# Altium schematic sheet Main.SchDoc
size A4; SheetNumber: 1; SheetTotal: 8
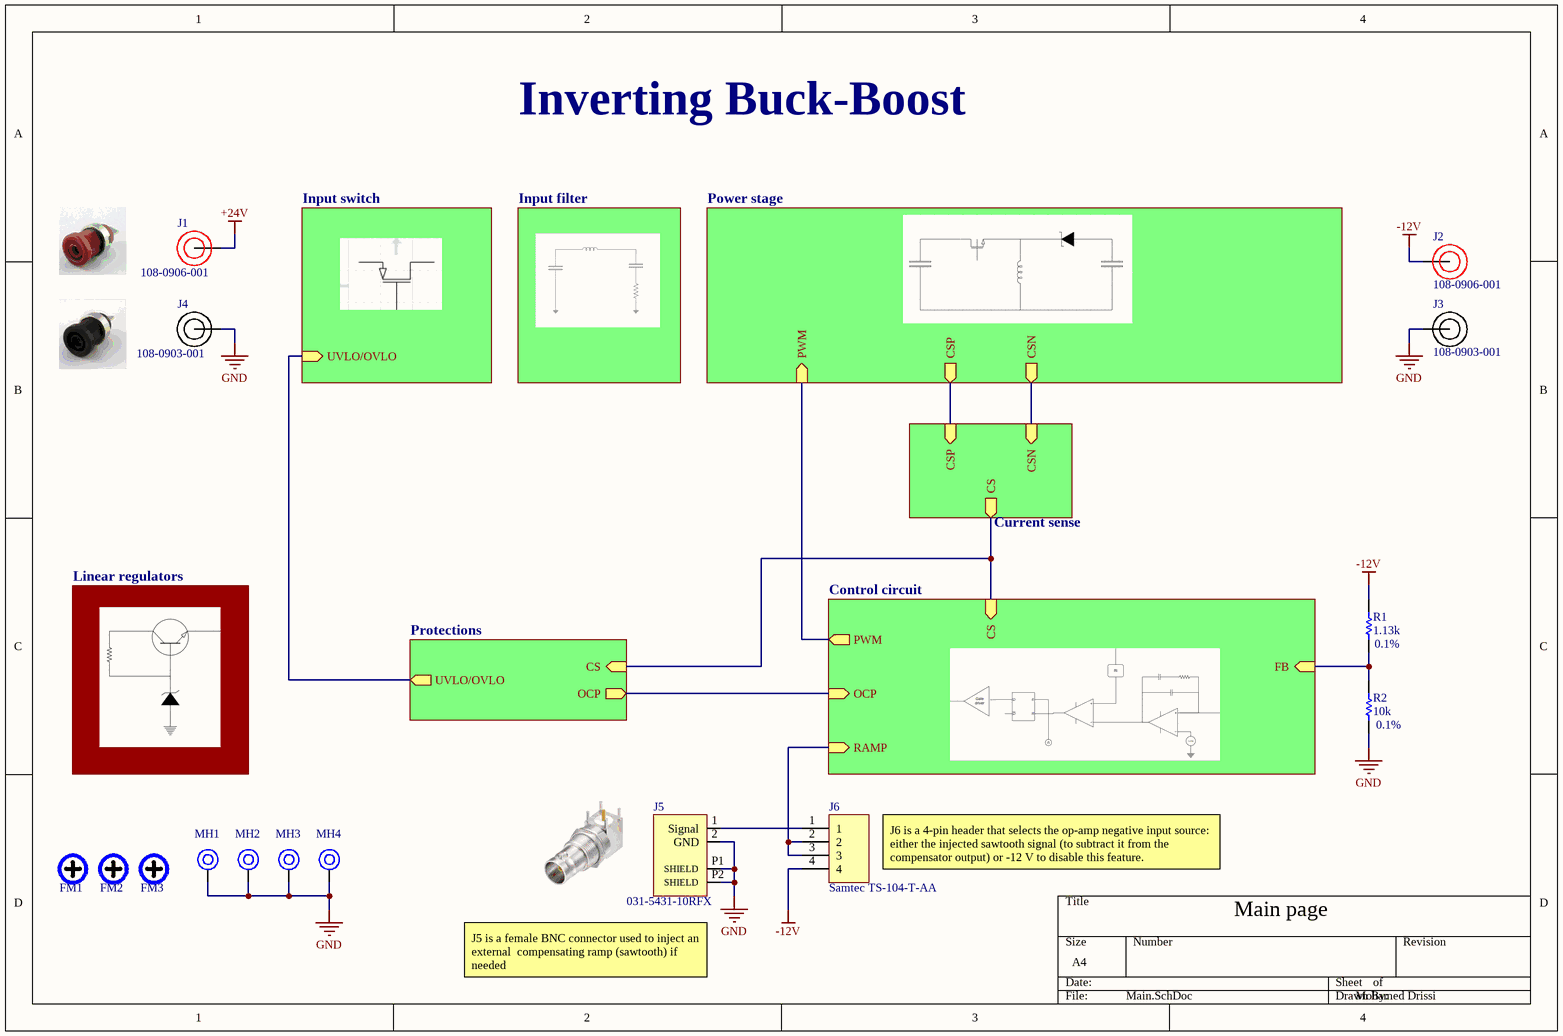
[diagram p0: Main.SchDoc]

## Parts
FM1  Fiducial Marker  [FIDUCIAL_CROSS_1MM5]  (value not drawn)  (no BOM)
FM2  Fiducial Marker  [FIDUCIAL_CROSS_1MM5]  (value not drawn)  (no BOM)
FM3  Fiducial Marker  [FIDUCIAL_CROSS_1MM5]  (value not drawn)  (no BOM)
J1  108-0906-001  [Black Banana connector Solder terminal]
J2  108-0906-001  [Black Banana connector Solder terminal]
J3  108-0903-001  [Black Banana connector Solder terminal]
J4  108-0903-001  [Black Banana connector Solder terminal]
J5  031-5431-10RFX  [031-5431-10RFX BNC]
J6  Samtec TS-104-T-AA  [CONN HEADER VERT 4POS 2.54MM]
MH1  Mounting Hole  [MOUNTING]  (value not drawn)  (no BOM)
MH2  Mounting Hole  [MOUNTING]  (value not drawn)  (no BOM)
MH3  Mounting Hole  [MOUNTING]  (value not drawn)  (no BOM)
MH4  Mounting Hole  [MOUNTING]  (value not drawn)  (no BOM)
R1  Tolerance: 0.1%  Resistance: 1.13k  [RES_0603]  (hidden comment: RT0603BRD071K13L)
R2  Tolerance: 0.1%  Resistance: 10k  [res_0603]  (hidden comment: ERA-3AEB103V)

## Sub-sheets
Control circuit = Control circuit.SchDoc: FB (in), CS (in), RAMP (in), PWM (out), OCP (in)
Current sense = current sense.SchDoc: CSP (in), CSN (in), CS (out)
Input filter = Input filter.SchDoc: no entries
Input switch = Input switch.SchDoc: UVLO/OVLO (in)
Linear regulators = Linear regulators.SchDoc: no entries
Power stage = Power stage.SchDoc: CSN (out), CSP (out), PWM (in)
Protections = Protections.SchDoc: UVLO/OVLO (out), CS (in), OCP (out)

## Nets
+24V: J1.1
-12V: J2.1 J6.4 R1.2
GND: J3.1 J4.1 J5.2(GND) J5.P1(SHIELD) J5.P2(SHIELD) MH1.1 MH2.1 MH3.1 MH4.1 R2.1
NetJ5_1: J5.1(Signal) J6.1
NetJ6_2: J6.2 J6.3 ; sheet Control circuit/RAMP
NetR1_1: R1.1 R2.2 ; sheet Control circuit/FB
(unnamed): sheet Power stage/CSN, sheet Current sense/CSN
(unnamed): sheet Power stage/CSP, sheet Current sense/CSP
(unnamed): sheet Power stage/PWM, sheet Control circuit/PWM
(unnamed): sheet Current sense/CS, sheet Protections/CS, sheet Control circuit/CS
(unnamed): sheet Input switch/UVLO/OVLO, sheet Protections/UVLO/OVLO
(unnamed): sheet Protections/OCP, sheet Control circuit/OCP

## Notes on the sheet
- Inverting Buck-Boost
- J6 is a 4-pin header that selects the op-amp negative input source: either the injected sawtooth signal (to subtract it from the compensator output) or -12 V to disable this feature.
- Main page
- (near J5) J5 is a female BNC connector used to inject an external  compensating ramp (sawtooth) if needed
- Mohamed Drissi

## Library data of the parts
FM1-FM3 = FIDUCIAL_CROSS_1MM5: Fiducial Marker Cross 1.5mm NO BOM
J1 J2 = Cinch 108-0906-001: Right-angle Dual Port D-Sub Connector; Manufacturer: Cinch Connectivity Solutions; Approvals: UL; Body Material: Brass, Nylon, Polyamide; Current Rating: 15A; Gender: Female; Insulation: Mating End Insulated; Number of Contacts: 1; Voltage Rating: 3.5kV; Voltage Rating (DC): 7kV; Wire/Cable Gauge: 12AWG; Supplier: Avnet; Supplier Part Number: 39F1578; Manufacturer Part Number: 108-0906-001; RoHS: Compliant; Category: Connectors; Stock: 6182; Pricing: 1=1,33, 10=1,13, 50=1,03, 100=0,961, 250=0,9, 500=0,857, 1000=0,816 (USD); Case/Package: 0906; Color: Orange; Contact Material: Brass; Contact Plating: Tin; Export Control Classification Number (ECCN) Code: EAR99; Insulation Material: Nylon; Lead Free: Lead Free; Length: 23.83mm; Lifecycle Status: Production; Max Current Rating: 15A; Max Operating Temperature: 85°C; Min Operating Temperature: -55°C; Mounting Technology: Panel; Orientation: Straight; Packaging: Bulk; Radiation Hardening: No; REACH SVHC: No; Termination: Solder; ComponentLink1URL: https://datasheet.octopart.com:443/108-0906-001-Cinch-Connectors-datasheet-87927859.pdf?src-supplier=element14+APAC; ComponentLink1Description: https://datasheet.octopart.com:443/108-0906-001-Cinch-Connectors-datasheet-87927859.pdf?src-supplier=element14+APAC; ComponentLink2URL: https://datasheet.octopart.com:443/108-0906-001-Cinch-Connectors-datasheet-26078.pdf?src-supplier=element14+APAC; ComponentLink2Description: https://datasheet.octopart.com:443/108-0906-001-Cinch-Connectors-datasheet-26078.pdf?src-supplier=element14+APAC; ComponentLink3URL: https://datasheet.octopart.com:443/108-0906-001-Cinch-Connectivity-Solutions-datasheet-180501184.pdf?src-supplier=IHS; ComponentLink3Description: https://datasheet.octopart.com:443/108-0906-001-Cinch-Connectivity-Solutions-datasheet-180501184.pdf?src-supplier=IHS; ComponentLink4URL: https://datasheet.octopart.com:443/108-0906-001-Cinch-Connectors-datasheet-13703871.pdf?src-supplier=_legacy+Avnet; ComponentLink4Description: https://datasheet.octopart.com:443/108-0906-001-Cinch-Connectors-datasheet-13703871.pdf?src-supplier=_legacy+Avnet; ComponentLink5URL: https://datasheet.octopart.com:443/108-0906-001-Cinch-Connectivity-Solutions-datasheet-128871933.pdf?src-supplier=RS+(Formerly+Allied+Electronics); ComponentLink5Description: https://datasheet.octopart.com:443/108-0906-001-Cinch-Connectivity-Solutions-datasheet-128871933.pdf?src-supplier=RS+(Formerly+Allied+Electronics); ComponentLink6URL: https://datasheet.octopart.com:443/108-0906-001-Cinch-Connectors-datasheet-10014739.pdf?src-supplier=RS+(Formerly+Allied+Electronics); ComponentLink6Description: https://datasheet.octopart.com:443/108-0906-001-Cinch-Connectors-datasheet-10014739.pdf?src-supplier=RS+(Formerly+Allied+Electronics); ComponentLink7URL: https://datasheet.octopart.com:443/108-0906-001-Emerson-Network-Power-datasheet-16473276.pdf?src-supplier=Farnell; ComponentLink7Description: https://datasheet.octopart.com:443/108-0906-001-Emerson-Network-Power-datasheet-16473276.pdf?src-supplier=Farnell
J3 J4 = Cinch 108-0903-001: Banana Test Connector, 4mm, Jack, Panel Mount, 15 A, 7 kV, Tin Plated Contacts, Black; Manufacturer: Cinch Connectivity Solutions; Approvals: UL; Body Material: Brass, Nylon, Polyamide; Current Rating: 15A; Gender: Female; Insulation: Mating End Insulated; Number of Contacts: 1; Voltage Rating: 3.5kV; Voltage Rating (DC): 7kV; Wire/Cable Gauge: 12AWG; Supplier: RS; Supplier Part Number: 8860910; Manufacturer Part Number: 108-0903-001; RoHS: Compliant; Category: Connectors; Stock: 5600; Pricing: 50=0,928, 500=0,742, 1000=0,699 (EUR); Color: Black; Contact Material: Tin; Contact Plating: Tin; Country of Origin: USA; Export Control Classification Number (ECCN) Code: EAR99; Insulation Material: Nylon; Lead Free: Lead Free; Length: 23.83mm; Lifecycle Status: Production; Max Current Rating: 15A; Max Operating Temperature: 85°C; Min Operating Temperature: -55°C; Mounting Technology: Panel; Orientation: Straight; Packaging: Bulk; Radiation Hardening: No; REACH SVHC: No; Termination: Solder; ComponentLink1URL: https://datasheet.octopart.com:443/108-0903-001-Cinch-Connectivity-Solutions-datasheet-128871933.pdf?src-supplier=JRH+Electronics; ComponentLink1Description: https://datasheet.octopart.com:443/108-0903-001-Cinch-Connectivity-Solutions-datasheet-128871933.pdf?src-supplier=JRH+Electronics; ComponentLink2URL: https://datasheet.octopart.com:443/108-0903-001-Cinch-Connectors-datasheet-38159153.pdf?src-supplier=element14+APAC; ComponentLink2Description: https://datasheet.octopart.com:443/108-0903-001-Cinch-Connectors-datasheet-38159153.pdf?src-supplier=element14+APAC; ComponentLink3URL: https://datasheet.octopart.com:443/108-0903-001-Cinch-Connectivity-Solutions-datasheet-180501184.pdf?src-supplier=IHS; ComponentLink3Description: https://datasheet.octopart.com:443/108-0903-001-Cinch-Connectivity-Solutions-datasheet-180501184.pdf?src-supplier=IHS; ComponentLink4URL: https://datasheet.octopart.com:443/108-0903-001-Emerson-Network-Power-datasheet-82039.pdf?src-supplier=element14; ComponentLink4Description: https://datasheet.octopart.com:443/108-0903-001-Emerson-Network-Power-datasheet-82039.pdf?src-supplier=element14; ComponentLink5URL: https://datasheet.octopart.com:443/108-0903-001-Cinch-Connectors-datasheet-13701575.pdf?src-supplier=_legacy+Avnet; ComponentLink5Description: https://datasheet.octopart.com:443/108-0903-001-Cinch-Connectors-datasheet-13701575.pdf?src-supplier=_legacy+Avnet; ComponentLink6URL: https://datasheet.octopart.com:443/108-0903-001-Cinch-Connectors-datasheet-9780463.pdf?src-supplier=RS+(Formerly+Allied+Electronics); ComponentLink6Description: https://datasheet.octopart.com:443/108-0903-001-Cinch-Connectors-datasheet-9780463.pdf?src-supplier=RS+(Formerly+Allied+Electronics); ComponentLink7URL: https://datasheet.octopart.com:443/108-0903-001-Emerson-Network-Power-datasheet-8828422.pdf?src-supplier=Farnell; ComponentLink7Description: https://datasheet.octopart.com:443/108-0903-001-Emerson-Network-Power-datasheet-8828422.pdf?src-supplier=Farnell; ComponentLink8URL: https://datasheet.octopart.com:443/108-0903-001-Emerson-Network-Power-datasheet-10031126.pdf?src-supplier=Farnell; ComponentLink8Description: https://datasheet.octopart.com:443/108-0903-001-Emerson-Network-Power-datasheet-10031126.pdf?src-supplier=Farnell; ComponentLink9URL: https://datasheet.octopart.com:443/108-0903-001-Emerson-Network-Power-datasheet-47159.pdf?src-supplier=Farnell; ComponentLink9Description: https://datasheet.octopart.com:443/108-0903-001-Emerson-Network-Power-datasheet-47159.pdf?src-supplier=Farnell; ComponentLink10URL: https://datasheet.octopart.com:443/108-0903-001-Emerson-Network-Power-datasheet-40124.pdf?src-supplier=Farnell; ComponentLink10Description: https://datasheet.octopart.com:443/108-0903-001-Emerson-Network-Power-datasheet-40124.pdf?src-supplier=Farnell; ComponentLink11URL: https://datasheet.octopart.com:443/108-0903-001-Emerson-Network-Power-datasheet-29036.pdf?src-supplier=Farnell; ComponentLink11Description: https://datasheet.octopart.com:443/108-0903-001-Emerson-Network-Power-datasheet-29036.pdf?src-supplier=Farnell
J5 = Amphenol 031-5431-10RFX: RF BNC Connector, Female, Panel Mount, Board And Panel Mount, Solder Terminal, Jack; Manufacturer: Amphenol RF; Body Material: Zinc; Body Plating: Nickel; Connector Type: Receptacle; Dielectric Material: Polypropylene; Frequency: 4GHz; Impedance: 50Ω; Insertion Loss (dB): 0.2dB; Clock Frequency: 1GHz; Polarity: Standard; Voltage Rating: 500V; Supplier: RS; Supplier Part Number: 1440890; Manufacturer Part Number: 031-5431-10RFX; RoHS: Compliant; Category: RF / Coaxial Connectors; Stock: 106; Pricing: 2=3,93, 20=3,77, 40=3,46, 100=3,145, 200=2,985 (EUR); Contact Material: Bronze, Copper; Contact Plating: Gold; Export Control Classification Number (ECCN) Code: EAR99; Fastening Type: Bayonet; Gender: Female; Housing Color: White; Harmonized Tariff Schedule (HTS) Code: 8536.69.40.10; Introduction Date: 2000-11-01; Lifecycle Status: Production; Max Operating Temperature: 85°C; Min Operating Temperature: -55°C; Mounting Technology: Bulkhead, PCB, Panel, Through Hole; Orientation: Right Angle; Plating: Nickel; Radiation Hardening: No; REACH SVHC: Unknown; Schedule B: 8536695050, 8536695050|8536695050, 8536695050|8536695050|8536695050, 8536695050|8536695050|8536695050|8536695050; Termination: Solder; ComponentLink1URL: https://datasheet.octopart.com:443/031-5431-10RFX-Amphenol-RF-datasheet-178912673.pdf?src-supplier=Amphenol+RF; ComponentLink1Description: https://datasheet.octopart.com:443/031-5431-10RFX-Amphenol-RF-datasheet-178912673.pdf?src-supplier=Amphenol+RF; ComponentLink2URL: https://datasheet.octopart.com:443/031-5431-10RFX-Amphenol-RF-datasheet-69052.pdf?src-supplier=RS+(Formerly+Allied+Electronics); ComponentLink2Description: https://datasheet.octopart.com:443/031-5431-10RFX-Amphenol-RF-datasheet-69052.pdf?src-supplier=RS+(Formerly+Allied+Electronics); ComponentLink3URL: https://datasheet.octopart.com:443/031-5431-10RFX-Amphenol-RF-datasheet-120229763.pdf?src-supplier=TME; ComponentLink3Description: https://datasheet.octopart.com:443/031-5431-10RFX-Amphenol-RF-datasheet-120229763.pdf?src-supplier=TME; ComponentLink4URL: https://datasheet.octopart.com:443/31-5431-10RFX-Amphenol-datasheet-110605730.pdf?src-supplier=IHS; ComponentLink4Description: https://datasheet.octopart.com:443/31-5431-10RFX-Amphenol-datasheet-110605730.pdf?src-supplier=IHS; ComponentLink5URL: https://datasheet.octopart.com:443/031-5431-10RFX-Amphenol-RF-datasheet-14873985.pdf?src-supplier=Electro+Sonic; ComponentLink5Description: https://datasheet.octopart.com:443/031-5431-10RFX-Amphenol-RF-datasheet-14873985.pdf?src-supplier=Electro+Sonic; ComponentLink6URL: https://datasheet.octopart.com:443/031-5431-10RFX-Amphenol-RF-datasheet-11551920.pdf?src-supplier=Electro+Sonic; ComponentLink6Description: https://datasheet.octopart.com:443/031-5431-10RFX-Amphenol-RF-datasheet-11551920.pdf?src-supplier=Electro+Sonic; ComponentLink7URL: https://datasheet.octopart.com:443/031-5431-10RFX-Amphenol-RF-datasheet-10025382.pdf?src-supplier=Newark; ComponentLink7Description: https://datasheet.octopart.com:443/031-5431-10RFX-Amphenol-RF-datasheet-10025382.pdf?src-supplier=Newark; ComponentLink8URL: https://datasheet.octopart.com:443/031-5431-10RFX-Amphenol-RF-datasheet-181430700.pdf?src-supplier=JRH+Electronics; ComponentLink8Description: https://datasheet.octopart.com:443/031-5431-10RFX-Amphenol-RF-datasheet-181430700.pdf?src-supplier=JRH+Electronics; ComponentLink9URL: https://datasheet.octopart.com:443/031-5431-10RFX.-Amphenol-RF-datasheet-5334842.pdf?src-supplier=element14+APAC; ComponentLink9Description: https://datasheet.octopart.com:443/031-5431-10RFX.-Amphenol-RF-datasheet-5334842.pdf?src-supplier=element14+APAC
J6 = Samtec TS-104-T-AA: Pin Header, Precision Machined Terminal, Board-to-Board, 2.54 mm, 1 Rows, 4 Contacts, Through Hole; Manufacturer Lifecycle Status: PRODUCTION; Gender: Male; Max Current Rating: 1A; Number of Contacts: 4; Pitch: 2.54mm; Supplier: RS; Supplier Part Number: 2001484; Manufacturer: Samtec; Manufacturer Part Number: TS-104-T-AA; RoHS: Compliant; Category: Board to Board Connectors; Stock: 2; Pricing: 1=0,88, 10=0,71, 100=0,63, 250=0,56 (EUR); Contact Material: Brass; Contact Plating: Tin; Lifecycle Status: Production; Max Operating Temperature: 105°C; Min Operating Temperature: -55°C; Mounting Technology: Through Hole; Number of Rows: 1; Orientation: Straight; Radiation Hardening: No; REACH SVHC: No; Termination: Solder; ComponentLink1URL: https://datasheet.octopart.com:443/TS-104-T-AA-Samtec-datasheet-97318998.pdf?src-supplier=Master+Electronics; ComponentLink1Description: https://datasheet.octopart.com:443/TS-104-T-AA-Samtec-datasheet-97318998.pdf?src-supplier=Master+Electronics; ComponentLink2URL: https://datasheet.octopart.com:443/TS-104-T-AA-Samtec-datasheet-150856305.pdf?src-supplier=Electro+Sonic; ComponentLink2Description: https://datasheet.octopart.com:443/TS-104-T-AA-Samtec-datasheet-150856305.pdf?src-supplier=Electro+Sonic; ComponentLink3URL: https://datasheet.octopart.com:443/TS-104-T-AA-Samtec-datasheet-13698575.pdf?src-supplier=Electro+Sonic; ComponentLink3Description: https://datasheet.octopart.com:443/TS-104-T-AA-Samtec-datasheet-13698575.pdf?src-supplier=Electro+Sonic; ComponentLink4URL: https://datasheet.octopart.com:443/TS-104-T-AA-Samtec-datasheet-37173861.pdf?src-supplier=Electro+Sonic; ComponentLink4Description: https://datasheet.octopart.com:443/TS-104-T-AA-Samtec-datasheet-37173861.pdf?src-supplier=Electro+Sonic; ComponentLink5URL: https://datasheet.octopart.com:443/TS-104-T-AA-Samtec-datasheet-41643166.pdf?src-supplier=Farnell; ComponentLink5Description: https://datasheet.octopart.com:443/TS-104-T-AA-Samtec-datasheet-41643166.pdf?src-supplier=Farnell; ComponentLink6URL: https://datasheet.octopart.com:443/TS-104-T-AA-Samtec-datasheet-28904454.pdf?src-supplier=Farnell; ComponentLink6Description: https://datasheet.octopart.com:443/TS-104-T-AA-Samtec-datasheet-28904454.pdf?src-supplier=Farnell; ComponentLink7URL: https://datasheet.octopart.com:443/TS-104-T-AA-Samtec-datasheet-8451641.pdf?src-supplier=Farnell; ComponentLink7Description: https://datasheet.octopart.com:443/TS-104-T-AA-Samtec-datasheet-8451641.pdf?src-supplier=Farnell; ComponentLink8URL: https://datasheet.octopart.com:443/TS-104-T-AA-Samtec-datasheet-179090728.pdf?src-supplier=Sager+Electronics; ComponentLink8Description: https://datasheet.octopart.com:443/TS-104-T-AA-Samtec-datasheet-179090728.pdf?src-supplier=Sager+Electronics; ComponentLink9URL: https://datasheet.octopart.com:443/TS-104-T-AA-Samtec-datasheet-118235246.pdf?src-supplier=Sager+Electronics; ComponentLink9Description: https://datasheet.octopart.com:443/TS-104-T-AA-Samtec-datasheet-118235246.pdf?src-supplier=Sager+Electronics; ComponentLink10URL: https://datasheet.octopart.com:443/TS-104-T-AA-Samtec-datasheet-116533476.pdf?src-supplier=Toby+Electronics; ComponentLink10Description: https://datasheet.octopart.com:443/TS-104-T-AA-Samtec-datasheet-116533476.pdf?src-supplier=Toby+Electronics; ComponentLink11URL: https://datasheet.octopart.com:443/TS-104-T-AA-Samtec-datasheet-116536303.pdf?src-supplier=Toby+Electronics; ComponentLink11Description: https://datasheet.octopart.com:443/TS-104-T-AA-Samtec-datasheet-116536303.pdf?src-supplier=Toby+Electronics
MH1-MH4 = MH_3.5H_6D: Manufacturer Part Number: NA; Case/Package: TH; Manufacturer: NA; Supplier-1: NA
R1 = Panasonic RT0603BRD071K13L: Res Thin Film 0603 1.13K Ohm 0.1% 0.1W(1/10W) ±25ppm/C Pad SMD T/R; Manufacturer: Yageo Group; Max Power Dissipation: 100mW; Temperature Coefficient: 25ppm/°C; Voltage Rating: 75V; Voltage Rating (DC): 50V; Supplier: Arrow Electronics; Supplier Part Number: RT0603BRD071K13L; Manufacturer Part Number: RT0603BRD071K13L; RoHS: Compliant; Category: Chip SMD Resistors; Stock: 2853; Pricing: 1=0,0998, 10=0,0669, 25=0,0627, 50=0,0591, 100=0,0558, 250=0,0518, 500=0,049, 1000=0,0464 (USD); Case/Package: 0603; Case Code (Imperial): 0603; China RoHS: Non-Compliant; Composition: Thin Film; Contact Plating: Tin; Country of Origin: Mainland China, Taiwan; Depth: 800µm; Export Control Classification Number (ECCN) Code: EAR99; Height: 450µm; Harmonized Tariff Schedule (HTS) Code: 8533.21.00.30; Introduction Date: 2008-06-09; Lead Free: Lead Free; Length: 1.6mm; Lifecycle Status: Production; Max Operating Temperature: 155°C; Military Standard: Not; Min Operating Temperature: -55°C; Mounting Technology: Surface Mount; Number of Terminals: 2; Number of Terminations: 2; Power Rating: 100mW; Radiation Hardening: No; REACH SVHC: Yes; Schedule B: 8533210045, 8533210045|8533210045|8533210045|8533210045|8533210045; Termination: SMD/SMT; Weight: 2.012816mg; Width: 800µm; Working Voltage: 75V; ComponentLink1URL: https://datasheet.octopart.com:443/RT0603BRD071K13L-Yageo-datasheet-176402239.pdf?src-supplier=Future+Electronics; ComponentLink1Description: https://datasheet.octopart.com:443/RT0603BRD071K13L-Yageo-datasheet-176402239.pdf?src-supplier=Future+Electronics; ComponentLink2URL: https://datasheet.octopart.com:443/RT0603BRD071K13L-Yageo-datasheet-169971040.pdf?src-supplier=Future+Electronics; ComponentLink2Description: https://datasheet.octopart.com:443/RT0603BRD071K13L-Yageo-datasheet-169971040.pdf?src-supplier=Future+Electronics; ComponentLink3URL: https://datasheet.octopart.com:443/RT0603BRD071K13L-Yageo-datasheet-166250672.pdf?src-supplier=Future+Electronics; ComponentLink3Description: https://datasheet.octopart.com:443/RT0603BRD071K13L-Yageo-datasheet-166250672.pdf?src-supplier=Future+Electronics; ComponentLink4URL: https://datasheet.octopart.com:443/RT0603BRD071K13L-Yageo-datasheet-137700930.pdf?src-supplier=Future+Electronics; ComponentLink4Description: https://datasheet.octopart.com:443/RT0603BRD071K13L-Yageo-datasheet-137700930.pdf?src-supplier=Future+Electronics; ComponentLink5URL: https://datasheet.octopart.com:443/RT0603BRD071K13L-Yageo-datasheet-96443642.pdf?src-supplier=Upverter; ComponentLink5Description: https://datasheet.octopart.com:443/RT0603BRD071K13L-Yageo-datasheet-96443642.pdf?src-supplier=Upverter; ComponentLink6URL: https://datasheet.octopart.com:443/RT0603BRD071K13L-Yageo-Group-datasheet-141265893.pdf?src-supplier=ODG+(Origin+Data+Global); ComponentLink6Description: https://datasheet.octopart.com:443/RT0603BRD071K13L-Yageo-Group-datasheet-141265893.pdf?src-supplier=ODG+(Origin+Data+Global); ComponentLink7URL: https://datasheet.octopart.com:443/RT0603BRD071K13L-Yageo-datasheet-10915759.pdf?src-supplier=_legacy+Avnet; ComponentLink7Description: https://datasheet.octopart.com:443/RT0603BRD071K13L-Yageo-datasheet-10915759.pdf?src-supplier=_legacy+Avnet; ComponentLink8URL: https://datasheet.octopart.com/RT0603BRD071K13L-Yageo-datasheet-86813807.pdf; ComponentLink8Description: https://datasheet.octopart.com/RT0603BRD071K13L-Yageo-datasheet-86813807.pdf; ComponentLink9URL: http://sigma.octopart.com:80/conflict_mineral_statement/Yageo-company-3.pdf?src-supplier=Compliance+Statements; ComponentLink9Description: http://sigma.octopart.com:80/conflict_mineral_statement/Yageo-company-3.pdf?src-supplier=Compliance+Statements; ComponentLink10URL: http://sigma.octopart.com:80/rohs_statement/Yageo-company-2.pdf?src-supplier=Compliance+Statements; ComponentLink10Description: http://sigma.octopart.com:80/rohs_statement/Yageo-company-2.pdf?src-supplier=Compliance+Statements
R2 = Panasonic ERA-3AEB103V: Res Thin Film 0603 10K Ohm 0.1% 1/10W ±25ppm/°C Molded SMD SMD Punched Carrier T/R; Manufacturer Lifecycle Status: ACTIVE; Part Series: Thin Film Chip Resistors, High Reliability Type; Max Power Dissipation: 100mW; Voltage Rating: 75V; Supplier: RS; Supplier Part Number: 566890P; Manufacturer: Panasonic; Manufacturer Part Number: ERA-3AEB103V; RoHS: Compliant; Category: Chip SMD Resistors; Stock: 165600; Pricing: 50=0,056, 100=0,046, 250=0,04, 500=0,036 (EUR); Case/Package: 0603; Case Code (Imperial): 0603; Composition: Thin Film; Contact Plating: Tin; Country of Origin: Japan; Depth: 800µm; Export Control Classification Number (ECCN) Code: EAR99; Height: 450µm; Harmonized Tariff Schedule (HTS) Code: 8533.21.00.30; Introduction Date: 2008-03-19; Lead Free: Lead Free; Length: 1.6mm; Lifecycle Status: Production; Max Operating Temperature: 155°C; Military Standard: Not; Min Operating Temperature: -55°C; Mounting Technology: Surface Mount; Pins: 2; Number of Terminals: 2; Number of Terminations: 2; Packaging: Cut Tape; Power Rating: 100mW; Radiation Hardening: No; Ratings: AEC-Q200; REACH SVHC: Yes; Schedule B: 8533210045, 8533210045|8533210045|8533210045|8533210045|8533210045|8533210045|8533210045|8533210045|8533210045|8533210045|8533210045|8533210045|8533210045|8533210045|8533210045|8533210045|8533210045|8533210045|8533210045|8533210045|8533210045|8533210045|8533210045|85; Temperature Coefficient: 25ppm/°C; Termination: SMD/SMT; Voltage Rating (DC): 75V; Width: 800µm; Working Voltage: 75V; ComponentLink1URL: https://datasheet.octopart.com:443/ERA-3AEB103V-Panasonic-datasheet-62287448.pdf?src-supplier=Newark; ComponentLink1Description: https://datasheet.octopart.com:443/ERA-3AEB103V-Panasonic-datasheet-62287448.pdf?src-supplier=Newark; ComponentLink2URL: https://datasheet.octopart.com:443/ERA-3AEB103V-Panasonic-datasheet-118567.pdf?src-supplier=Newark; ComponentLink2Description: https://datasheet.octopart.com:443/ERA-3AEB103V-Panasonic-datasheet-118567.pdf?src-supplier=Newark; ComponentLink3URL: https://datasheet.octopart.com:443/ERA-3AEB103V-Panasonic-datasheet-61114971.pdf?src-supplier=Newark; ComponentLink3Description: https://datasheet.octopart.com:443/ERA-3AEB103V-Panasonic-datasheet-61114971.pdf?src-supplier=Newark; ComponentLink4URL: https://datasheet.octopart.com:443/ERA3AEB103V-Panasonic-datasheet-22087624.pdf?src-supplier=Newark; ComponentLink4Description: https://datasheet.octopart.com:443/ERA3AEB103V-Panasonic-datasheet-22087624.pdf?src-supplier=Newark; ComponentLink5URL: https://sigma.octopart.com:443/138766958/technical_drawing/Panasonic-ERA-3AEB103V.pdf?src-supplier=Upverter; ComponentLink5Description: https://sigma.octopart.com:443/138766958/technical_drawing/Panasonic-ERA-3AEB103V.pdf?src-supplier=Upverter; ComponentLink6URL: https://datasheet.octopart.com:443/ERA-3AEB103V-Panasonic-datasheet-136531316.pdf?src-supplier=Farnell; ComponentLink6Description: https://datasheet.octopart.com:443/ERA-3AEB103V-Panasonic-datasheet-136531316.pdf?src-supplier=Farnell; ComponentLink7URL: https://datasheet.octopart.com:443/ERA-3AEB103V-Panasonic-datasheet-13266200.pdf?src-supplier=RS+(Formerly+Allied+Electronics); ComponentLink7Description: https://datasheet.octopart.com:443/ERA-3AEB103V-Panasonic-datasheet-13266200.pdf?src-supplier=RS+(Formerly+Allied+Electronics); ComponentLink8URL: https://datasheet.octopart.com:443/ERA-3AEB103V-Panasonic-datasheet-46744048.pdf?src-supplier=RS+(Formerly+Allied+Electronics); ComponentLink8Description: https://datasheet.octopart.com:443/ERA-3AEB103V-Panasonic-datasheet-46744048.pdf?src-supplier=RS+(Formerly+Allied+Electronics); ComponentLink9URL: https://datasheet.octopart.com:443/ERA-3AEB103V-Panasonic-datasheet-10840895.pdf?src-supplier=Future+Electronics; ComponentLink9Description: https://datasheet.octopart.com:443/ERA-3AEB103V-Panasonic-datasheet-10840895.pdf?src-supplier=Future+Electronics; ComponentLink10URL: https://datasheet.octopart.com:443/ERA-3AEB103V-Panasonic-datasheet-8367715.pdf?src-supplier=Future+Electronics; ComponentLink10Description: https://datasheet.octopart.com:443/ERA-3AEB103V-Panasonic-datasheet-8367715.pdf?src-supplier=Future+Electronics; ComponentLink11URL: https://datasheet.octopart.com:443/ERA-3AEB103V-Panasonic-datasheet-12510007.pdf?src-supplier=Future+Electronics; ComponentLink11Description: https://datasheet.octopart.com:443/ERA-3AEB103V-Panasonic-datasheet-12510007.pdf?src-supplier=Future+Electronics; ComponentLink12URL: https://datasheet.octopart.com:443/ERA-3AEB103V-Panasonic-datasheet-11763931.pdf?src-supplier=Future+Electronics; ComponentLink12Description: https://datasheet.octopart.com:443/ERA-3AEB103V-Panasonic-datasheet-11763931.pdf?src-supplier=Future+Electronics; ComponentLink13URL: https://datasheet.octopart.com:443/ERA-3AEB103V-Panasonic-datasheet-5392808.pdf?src-supplier=Future+Electronics; ComponentLink13Description: https://datasheet.octopart.com:443/ERA-3AEB103V-Panasonic-datasheet-5392808.pdf?src-supplier=Future+Electronics; ComponentLink14URL: https://datasheet.octopart.com:443/ERA-3AEB103V-Panasonic-datasheet-154766165.pdf?src-supplier=Master+Electronics; ComponentLink14Description: https://datasheet.octopart.com:443/ERA-3AEB103V-Panasonic-datasheet-154766165.pdf?src-supplier=Master+Electronics; ComponentLink15URL: https://datasheet.octopart.com:443/ERA3AEB103V-Panasonic-datasheet-188913046.pdf?src-supplier=TME; ComponentLink15Description: https://datasheet.octopart.com:443/ERA3AEB103V-Panasonic-datasheet-188913046.pdf?src-supplier=TME; ComponentLink16URL: https://sigma.octopart.com:443/150570796/technical_drawing/Panasonic-ERA3AEB103V.pdf?src-supplier=Panasonic+SCT; ComponentLink16Description: https://sigma.octopart.com:443/150570796/technical_drawing/Panasonic-ERA3AEB103V.pdf?src-supplier=Panasonic+SCT; ComponentLink17URL: https://datasheet.octopart.com:443/ERA3AEB103V-Panasonic-datasheet-138783076.pdf?src-supplier=Burklin+Elektronik; ComponentLink17Description: https://datasheet.octopart.com:443/ERA3AEB103V-Panasonic-datasheet-138783076.pdf?src-supplier=Burklin+Elektronik; ComponentLink18URL: https://datasheet.octopart.com/ERA-3AEB103V-Panasonic-datasheet-78375410.pdf; ComponentLink18Description: https://datasheet.octopart.com/ERA-3AEB103V-Panasonic-datasheet-78375410.pdf; ComponentLink19URL: https://datasheet.octopart.com:443/ERA-3AEB103V-Panasonic-datasheet-10050158.pdf?src-supplier=Arrow+Electronics; ComponentLink19Description: https://datasheet.octopart.com:443/ERA-3AEB103V-Panasonic-datasheet-10050158.pdf?src-supplier=Arrow+Electronics; ComponentLink20URL: https://datasheet.octopart.com:443/ERA-3AEB103V-Panasonic-datasheet-33006989.pdf?src-supplier=Electro+Sonic; ComponentLink20Description: https://datasheet.octopart.com:443/ERA-3AEB103V-Panasonic-datasheet-33006989.pdf?src-supplier=Electro+Sonic